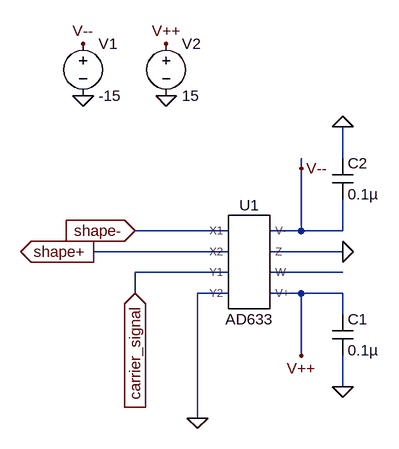
[diagram p0: schematic final_VCA(modulator).asc]
final_VCA(modulator).asc, the LTspice schematic file:
Version 4
SHEET 1 880 680
WIRE 528 -144 528 -192
WIRE 464 -128 464 -144
WIRE 352 -32 208 -32
WIRE 464 -32 464 -128
WIRE 464 -32 416 -32
WIRE 528 -32 528 -80
WIRE 528 -32 464 -32
WIRE 352 0 144 0
WIRE 528 0 416 0
WIRE 352 32 208 32
WIRE 528 32 416 32
WIRE 208 64 208 32
WIRE 352 64 304 64
WIRE 464 64 416 64
WIRE 528 64 464 64
WIRE 528 96 528 64
WIRE 464 160 464 64
WIRE 528 208 528 160
WIRE 304 256 304 64
FLAG 464 160 V++
FLAG 464 -128 V--
FLAG 304 256 0
FLAG 528 208 0
FLAG 528 -192 0
FLAG 528 0 0
FLAG 208 -32 shape-
IOPIN 208 -32 In
FLAG 144 0 shape+
IOPIN 144 0 Out
FLAG 208 64 carrier_signal
IOPIN 208 64 In
FLAG 128 -240 0
FLAG 256 -320 V++
FLAG 128 -320 V--
FLAG 256 -240 0
SYMBOL AutoGenerated\\AD633 384 16 R0
SYMATTR InstName U1
SYMBOL cap 512 96 R0
SYMATTR InstName C1
SYMATTR Value 0.1µ
SYMBOL cap 512 -144 R0
SYMATTR InstName C2
SYMATTR Value 0.1µ
SYMBOL voltage 128 -336 R0
WINDOW 123 0 0 Left 0
WINDOW 39 0 0 Left 0
SYMATTR InstName V1
SYMATTR Value -15
SYMBOL voltage 256 -336 R0
SYMATTR InstName V2
SYMATTR Value 15

The netlist it stands for:
* final_VCA(modulator).asc
XU1 shape- shape+ carrier_signal 0 V-- 0 N001 V++ AD633  ; pins X1 X2 Y1 Y2 V- Z W V+
C1 V++ 0 0.1µ
C2 0 V-- 0.1µ
V1 V-- 0 -15
V2 V++ 0 15
.lib C:\Users\hp\Documents\GitHub\EEE-Summer-Project-2020\AD633_imported.log
.backanno
.end